# Altium schematic sheet AC Outlet Top.SchDoc
size A
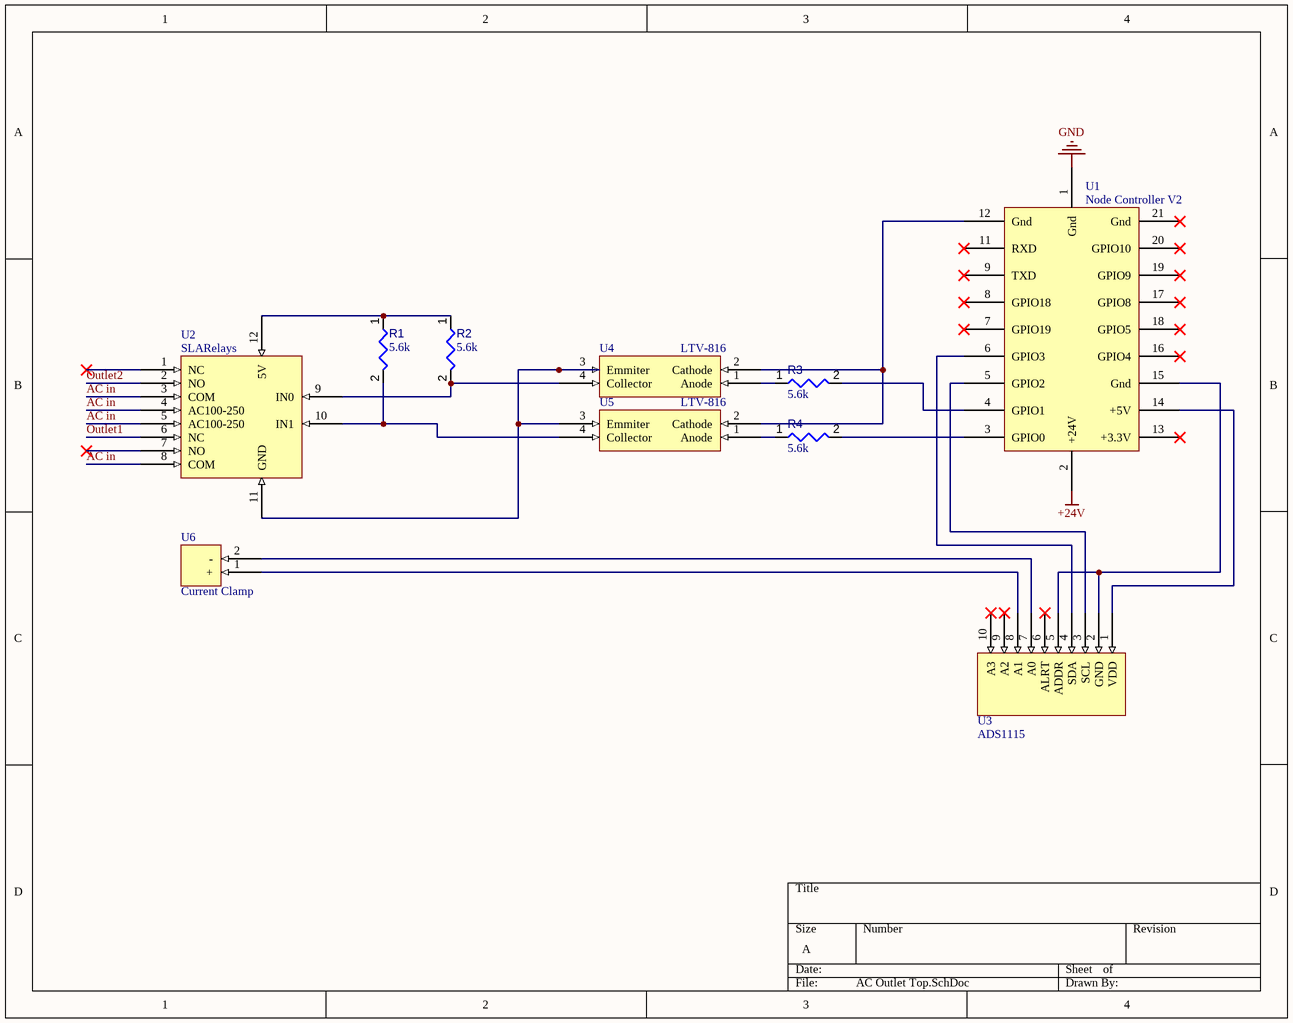
[diagram p0: AC Outlet Top.SchDoc]

## Parts
R1  value 5.6k  [RESC0402(1005)_L]  (hidden comment: Resistor 5K6  +/-5 % 0402 63 mW)
R2  value 5.6k  [RESC0402(1005)_L]  (hidden comment: Resistor 5K6  +/-5 % 0402 63 mW)
R3  value 5.6k  [RESC0402(1005)_L]  (hidden comment: Resistor 5K6  +/-5 % 0402 63 mW)
R4  value 5.6k  [RESC0402(1005)_L]  (hidden comment: Resistor 5K6  +/-5 % 0402 63 mW)
U1  Node Controller V2
U2  SLARelays
U3  ADS1115
U4  LTV-816
U5  LTV-816
U6  Current Clamp

## Nets
+24V: U1.2(+24V)
GND: U1.1(Gnd)
AC in: U2.3(COM) U2.4(AC100-250) U2.5(AC100-250) U2.8(COM)
Outlet1: U2.6(NC)
Outlet2: U2.2(NO)
NetR1_1: R1.1 R2.1 U2.12(5V)
NetR1_2: R1.2 U2.10(IN1) U5.4(Collector)
NetR2_2: R2.2 U2.9(IN0) U4.4(Collector)
NetR3_1: R3.1 U4.1(Anode)
NetR3_2: R3.2 U1.4(GPIO1)
NetR4_1: R4.1 U5.1(Anode)
NetR4_2: R4.2 U1.3(GPIO0)
NetU1_5: U1.5(GPIO2) U3.3(SCL)
NetU1_6: U1.6(GPIO3) U3.4(SDA)
NetU1_12: U1.12(Gnd) U4.2(Cathode) U5.2(Cathode)
NetU1_14: U1.14(+5V) U3.1(VDD)
NetU1_15: U1.15(Gnd) U3.2(GND) U3.5(ADDR)
NetU2_11: U2.11(GND) U4.3(Emmiter) U5.3(Emmiter)
NetU3_7: U3.7(A0) U6.2(-)
NetU3_8: U3.8(A1) U6.1(+)

Not connected (* = marked no-connect by the designer): U1 7(GPIO19)* 8(GPIO18)* 9(TXD)* 11(RXD)* 13(+3.3V)* 16(GPIO4)* 17(GPIO8)* 18(GPIO5)* 19(GPIO9)* 20(GPIO10)* 21(Gnd)*; U2 1(NC)* 7(NO)*; U3 6(ALRT)* 9(A2)* 10(A3)*

## Library data of the parts
R1-R4 = CMP-009-00136-3: Chip Resistor, 5,6 kOhms, +/-5 %, 63 mW, -55 to 155 degC, 0402; Power: 63mW; Tolerance: 5%; Max Operating Temperature: 155°C; Case/Package: 0402; Min Operating Temperature: -55°C; Pins: 2